# EAGLE design Yitran_IT900_Hutschiene_PIM7A_1_3 (EAGLE 6.4)
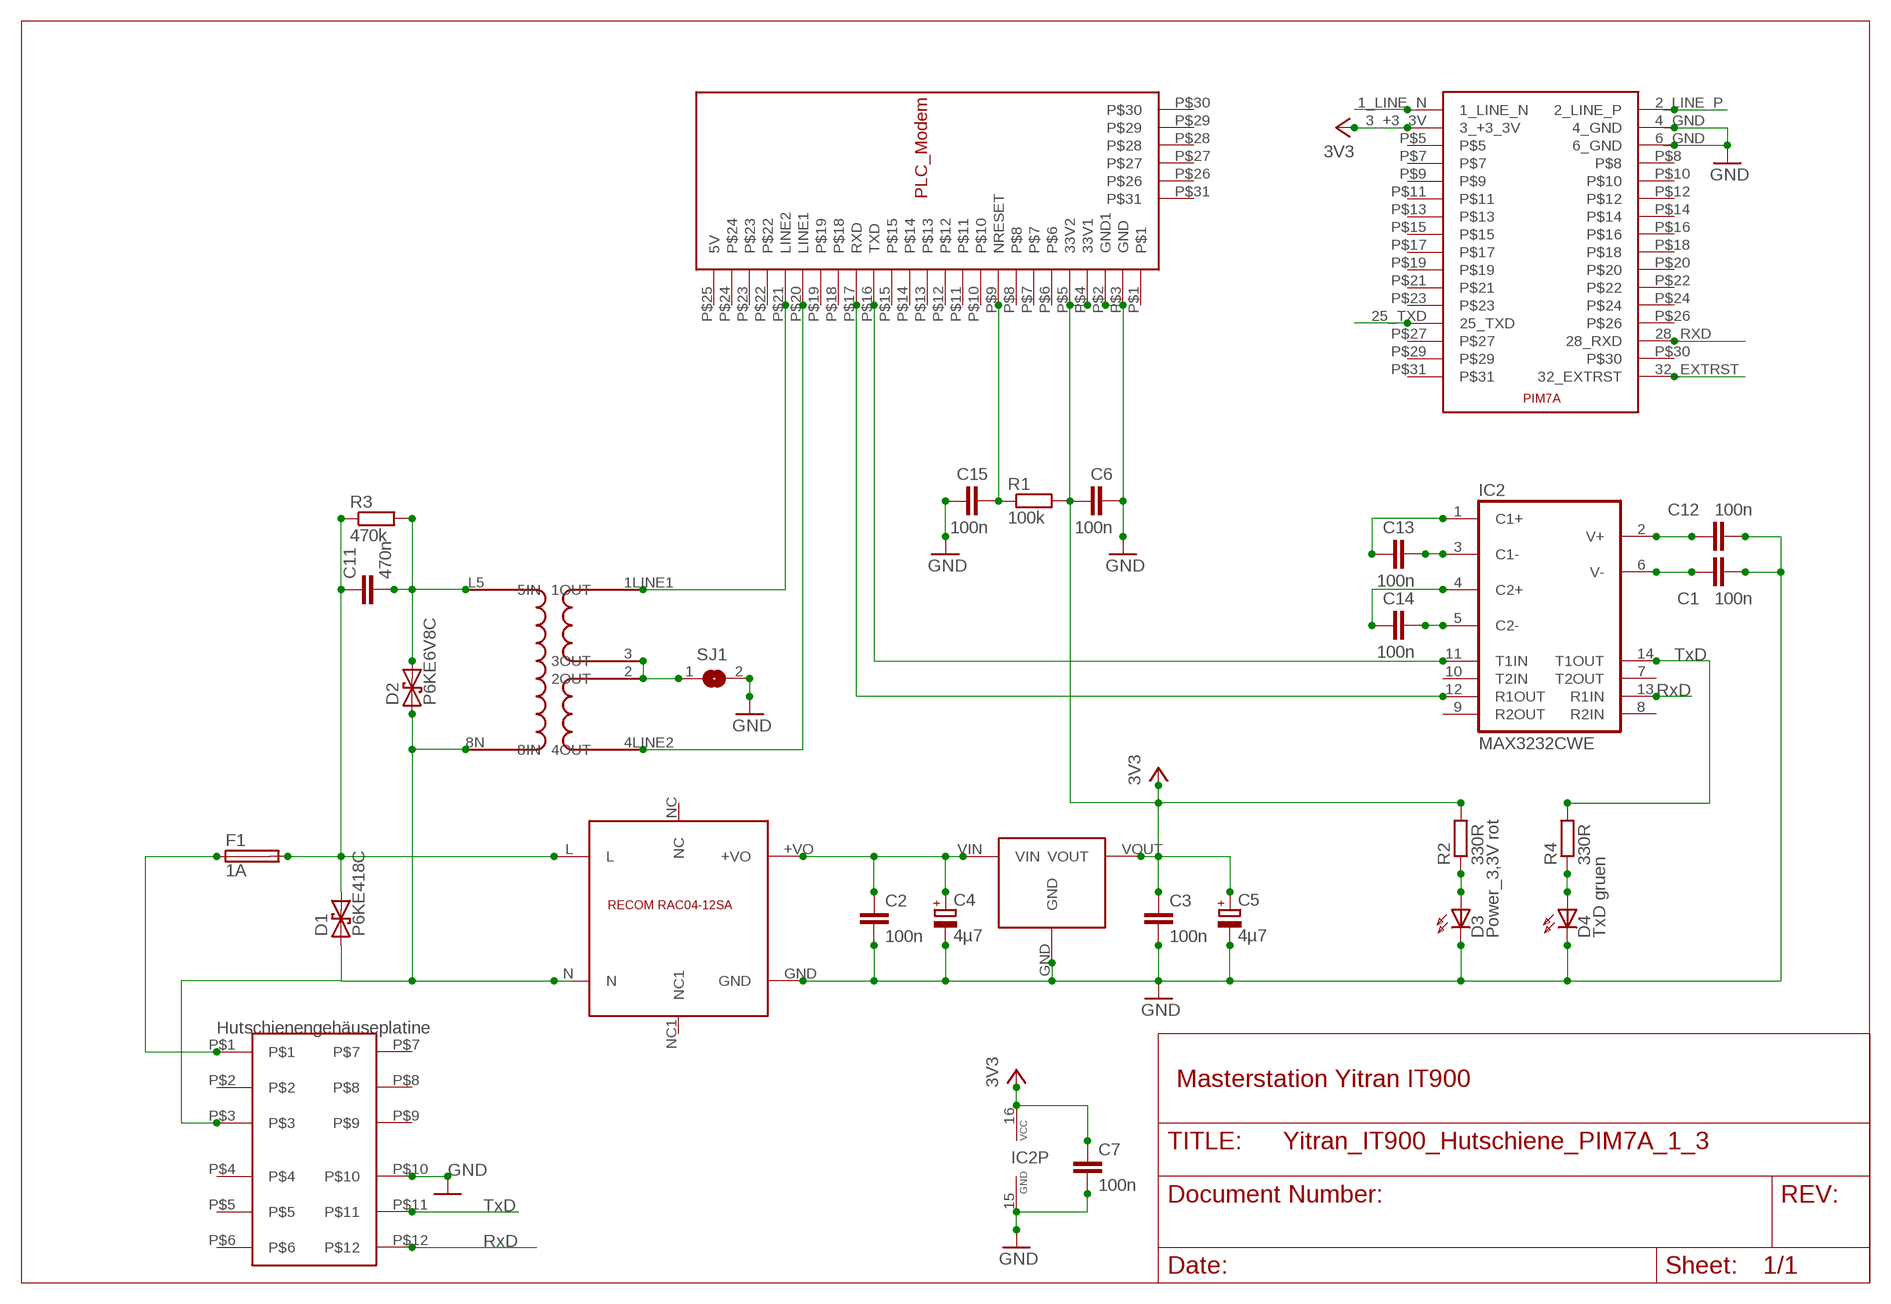
[diagram p0: schematic, sheet 1]

## Parts
C1  100n  C-EUC1206K  [C1206K]
C2  100n  C-EUC1206K  [C1206K]
C3  100n  C-EUC1206K  [C1206K]
C4  4µ7  CPOL-EUE2.5-5  [E2,5-5]
C5  4µ7  CPOL-EUE2.5-5  [E2,5-5]
C6  100n  C-EUC1206K  [C1206K]
C7  100n  C-EUC1206K  [C1206K]
C11  470n  C-EU150-091X182  [C150-091X182]
C12  100n  C-EUC1206K  [C1206K]
C13  100n  C-EUC1206K  [C1206K]
C14  100n  C-EUC1206K  [C1206K]
C15  100n  C-EUC1206K  [C1206K]
D1  P6KE418C  P6KEXXC  [CB417-15]
D2  P6KE6V8C  P6KEXXC  [CB417-15]
D3  Power_3,3V rot  HLMP6  [HLMP6]
D4  TxD gruen  HLMP6  [HLMP6]
F1  1A  TR5  [TR5]
IC2  MAX3232CWE  [SO16L]
R1  100k  R-EU_M1406  [M1406]
R2  330R  R-EU_R1206  [R1206]
R3  470k  R-EU_0309/10  [0309/10]
R4  330R  R-EU_R1206  [R1206]
SJ1  SJW  [SJW]
U$1  RECOM_783_3  RECOM_785_05  [RECOM785X]
U$2  LDG-A-12  [LDG-A-12]
U$3  MODEMSTECKER  [MODEM_FUSS]
U$4  IT900PIM7A  [IT900PIM7A]
U$9  RECOM_RAC04_12SA  [RAC04_12SA]
U$10  PLC_UEBERTRAGER_V2  [PLC-UEBERTRAGER_V2]

## Nets
3V3: C3.1 C5.+ C6.1 C7.1 IC2.16(VCC) R1.2 R2.2 U$1.VOUT U$3.P$4(33V1) U$3.P$5(33V2) U$4.3_+3_3V
EXTRST: C15.2 R1.1 U$3.P$9(NRESET) U$4.32_EXTRST
GND: C1.2 C2.2 C3.2 C4.- C5.- C6.2 C7.2 C12.2 C15.1 D3.K D4.K IC2.15(GND) SJ1.2 U$1.GND U$2.P$10 U$3.P$2(GND1) U$3.P$3(GND) U$4.4_GND U$4.6_GND U$9.GND
L: C11.1 D1.C F1.2 R3.1 U$9.L
LINE1: U$3.P$20(LINE1) U$4.1_LINE_N U$10.4LINE2(4OUT)
LINE2: U$3.P$21(LINE2) U$4.2_LINE_P U$10.1LINE1(1OUT)
N: D1.A D2.A U$2.P$3 U$9.N U$10.8N(8IN)
N$1: F1.1 U$2.P$1
N$2: C11.2 D2.C R3.2 U$10.L5(5IN)
N$3: C2.1 C4.+ U$1.VIN U$9.+VO
N$4: D3.A R2.1
N$5: C12.1 IC2.2(V+)
N$7: C13.1 IC2.1(C1+)
N$8: C13.2 IC2.3(C1-)
N$9: C14.1 IC2.4(C2+)
N$10: C14.2 IC2.5(C2-)
N$12: C1.1 IC2.6(V-)
N$13: D4.A R4.1
N$14: SJ1.1 U$10.2(2OUT) U$10.3(3OUT)
RX: IC2.12(R1OUT) U$3.P$17(RXD) U$4.28_RXD
RXD: IC2.13(R1IN) U$2.P$12
TX: IC2.11(T1IN) U$3.P$16(TXD) U$4.25_TXD
TXD: IC2.14(T1OUT) R4.2 U$2.P$11
Unconnected: IC2.7(T2OUT) IC2.8(R2IN) IC2.9(R2OUT) IC2.10(T2IN) U$2.P$2 U$2.P$4 U$2.P$5 U$2.P$6 U$2.P$7 U$2.P$8 U$2.P$9 U$3.P$1 U$3.P$6 U$3.P$7 U$3.P$8 U$3.P$10 U$3.P$11 U$3.P$12 U$3.P$13 U$3.P$14 U$3.P$15 U$3.P$18 U$3.P$19 U$3.P$22 U$3.P$23 U$3.P$24 U$3.P$25(5V) U$3.P$26 U$3.P$27 U$3.P$28 U$3.P$29 U$3.P$30 U$3.P$31 U$4.P$5 U$4.P$7 U$4.P$8 U$4.P$9 U$4.P$10 U$4.P$11 U$4.P$12 U$4.P$13 U$4.P$14 U$4.P$15 U$4.P$16 U$4.P$17 U$4.P$18 U$4.P$19 U$4.P$20 U$4.P$21 U$4.P$22 U$4.P$23 U$4.P$24 U$4.P$26 U$4.P$27 U$4.P$29 U$4.P$30 U$4.P$31 U$9.NC U$9.NC1

## Notes on the sheet
- TxD
- RxD
- Hutschienengehäuseplatine
- Masterstation Yitran IT900
- TxD
- RxD

## Library data of the parts
C1-C3 C6 C7 C11-C15 = resistor:C-EU: CAPACITOR, European symbol
C4 C5 = resistor:CPOL-EU: POLARIZED CAPACITOR, European symbol
D1 D2 = diode:P6KEXXC: DIODE transient-voltage suppressor
D3 D4 = display-hp:HLMP6: LED 2mm horizontal; MF: AGILENT TECHNOLOGIES; MPN: HLMP-6500; OC_FARNELL: 1652490; OC_NEWARK: 40K0088
F1 = fuse:TR5: FUSE Wickmann; OC_FARNELL: unknown; OC_NEWARK: unknown
IC2 = maxim:MAX3232*: True RS-232 Transceivers 3.0V to 5.5V, Low-Power up to 1Mbps, Using Four 0.1µF External Capacitors Source: http://pdfserv.maxim-ic.com/en/ds/MAX3222-MAX3241.pdf; MF: MAXIM; MPN: MAX3232CWE+; OC_FARNELL: 9725504; OC_NEWARK: 68K4630
R1-R4 = resistor:R-EU_: RESISTOR, European symbol
SJ1 = jumper:SJ: SMD solder JUMPER
U$1 = ADS:RECOM_785_05
U$2 = Erni_LDG_A_12_Leiterplatte:LDG-A-12
U$3 = ADS:MODEMSTECKER
U$4 = ADS1:IT900PIM7A
U$9 = ADS:RECOM_RAC04_12SA
U$10 = ADS:PLC_UEBERTRAGER_V2

## Board
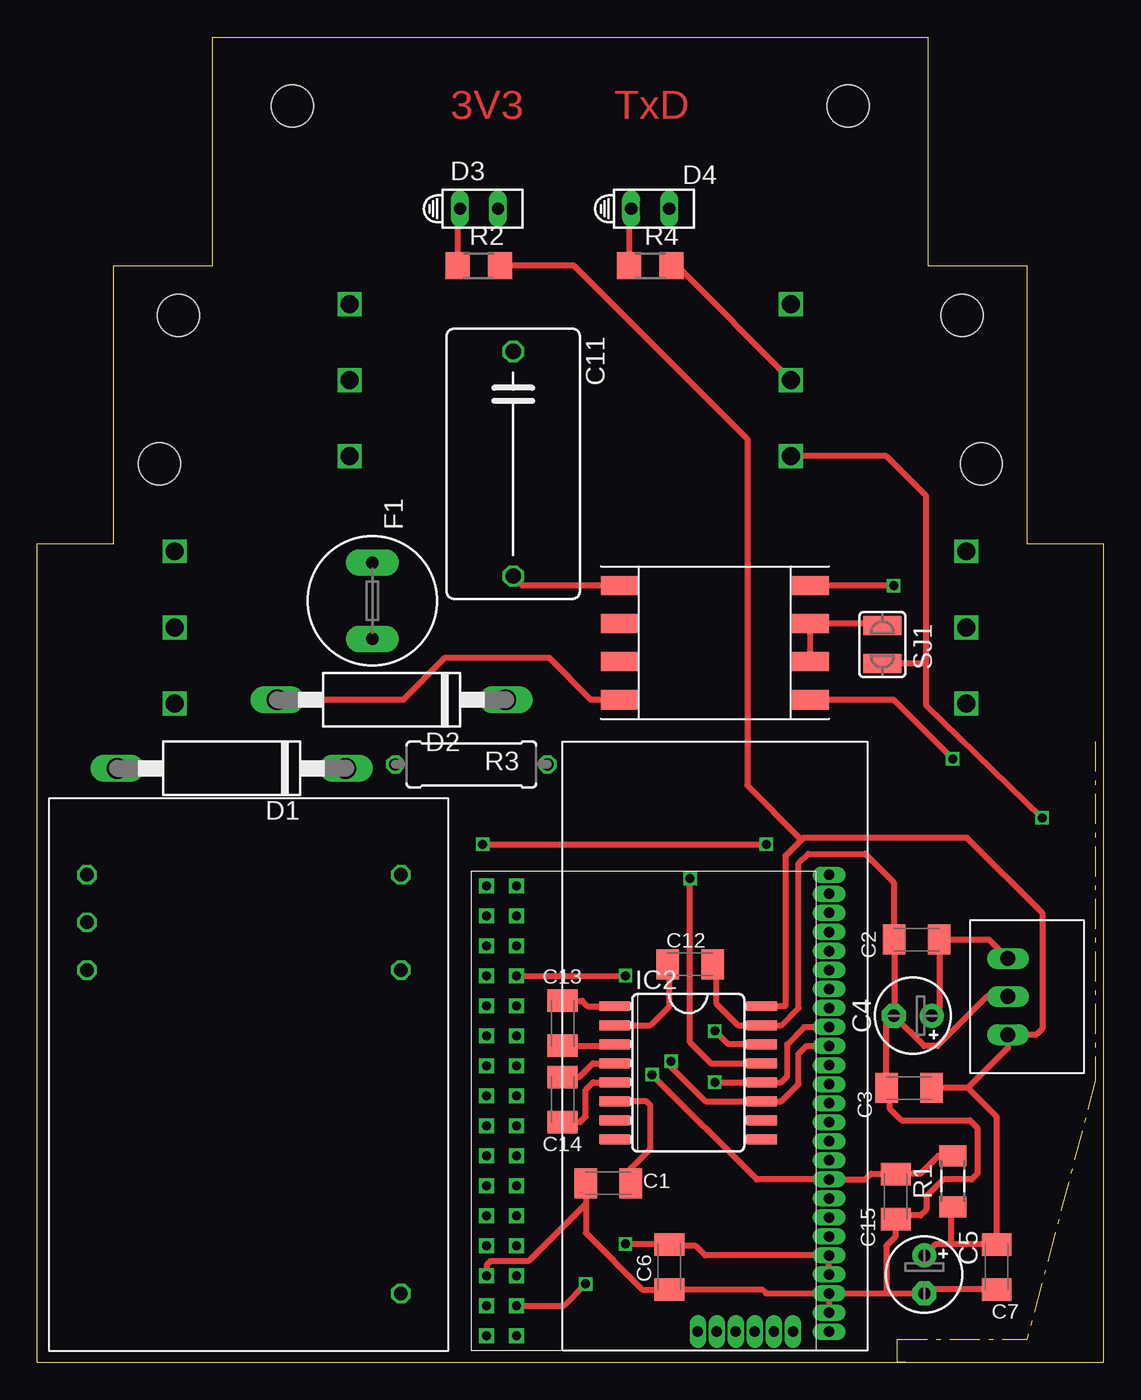
[diagram p1: board, top side]
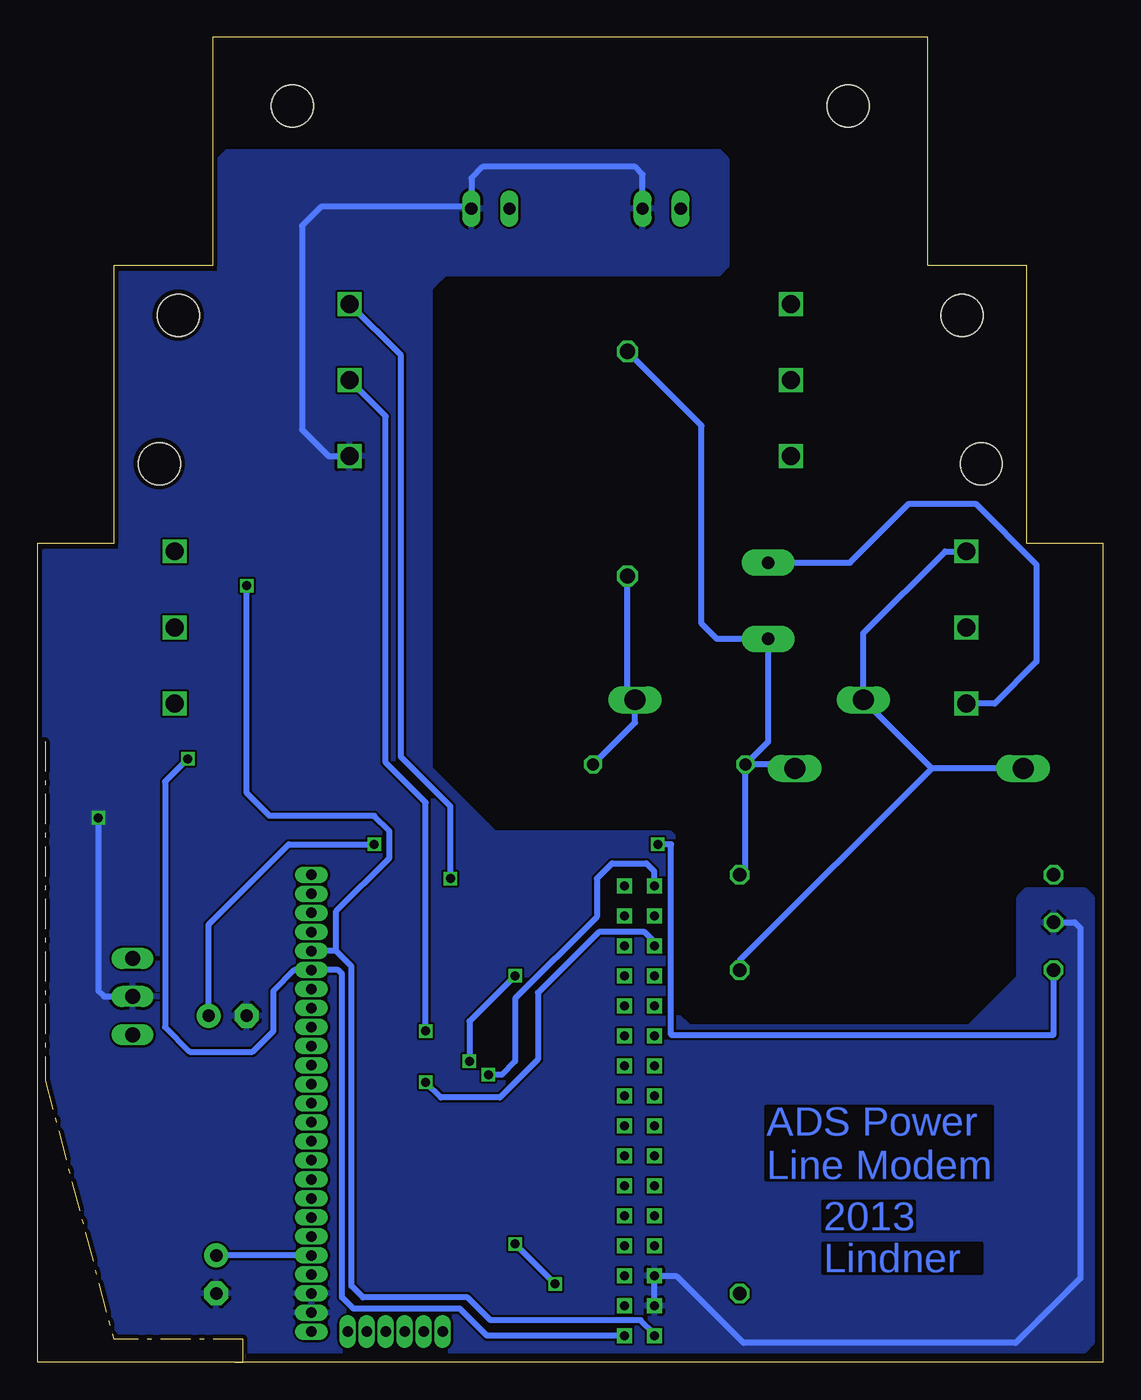
[diagram p2: board, bottom side, seen from below]

Size 71.12 x 88.39 mm. Coordinates in mm from the lower left corner, seen from the top.
Copper layers (1*16): Top 0.035mm / dielectric 1.5mm / Bottom 0.035mm
Design rules "PCB-POOL Standard": minimum track width 0.15mm, minimum drill 0.3mm, track to track 0.15mm, track to pad 0.15mm, pad to pad 0.15mm, via to via 0.15mm, smd to smd 0.15mm, copper to edge 0.3mm, drill to drill 0.2mm, minimum pad ring 0.2mm, minimum via ring 0.15mm, stop-mask expansion 0.075mm, vias tented up to drill 0mil, thermal gap 0.2mm

### Footprints (pad centres in the part's own frame; a part is rotated, then mirrored left to right if it is on the bottom)
C1206K = smd 1.5 x 2: 1 -1.5,0; 2 1.5,0
E2,5-5 = drill 0.813 pad 1.6: + -1.27,0 | drill 0.813 pad 1.6 octagon: - 1.27,0
C150-091X182 = drill 1.016 octagon: 1 -7.493,0; 2 7.493,0
CB417-15 = drill 1.397 long: A 7.62,0; C -7.62,0
HLMP6 = drill 0.813 long: A -1.27,0; K 1.27,0
TR5 = drill 0.813 pad 1.778 long: 1 -2.54,0; 2 2.54,0
SO16L = smd 0.66 x 2.032: 1 -4.445,-4.902; 2 -3.175,-4.902; 3 -1.905,-4.902; 4 -0.635,-4.902; 5 0.635,-4.902; 6 1.905,-4.902; 7 3.175,-4.902; 8 4.445,-4.902; 9 4.445,4.902; 10 3.175,4.902; 11 1.905,4.902; 12 0.635,4.902; 13 -0.635,4.902; 14 -1.905,4.902; 15 -3.175,4.902; 16 -4.445,4.902
M1406 = smd 1.4 x 1.8: 1 -1.7,0; 2 1.7,0
R1206 = smd 1.6 x 1.803: 1 -1.422,0; 2 1.422,0
0309/10 = drill 0.813 octagon: 1 -5.08,0; 2 5.08,0
SJW = smd 1.27 x 2.54: 1 -1.27,0; 2 1.27,0
RECOM785X = drill 1 long: GND 0,2.54; VIN -2.54,2.54; VOUT 2.54,2.54
LDG-A-12 = drill 1.2 square: P$1 -26.416,-44.45; P$2 -26.416,-39.37; P$3 -26.416,-34.29; P$4 -14.732,-27.94; P$5 -14.732,-22.86; P$6 -14.732,-17.78; P$7 26.416,-44.45; P$8 26.416,-39.37; P$9 26.416,-34.29; P$10 14.732,-27.94; P$11 14.732,-22.86; P$12 14.732,-17.78 | hole 2.8: -18.542,-4.572; 18.542,-4.572; 26.162,-18.542; -26.162,-18.542; -27.432,-28.448; 27.432,-28.448
MODEM_FUSS = drill 0.7 pad 0.813 long: P$1 -20.32,-8.89; P$2 -19.05,-8.89; P$3 -17.78,-8.89; P$4 -16.51,-8.89; P$5 -15.24,-8.89; P$6 -13.97,-8.89; P$7 -12.7,-8.89; P$8 -11.43,-8.89; P$9 -10.16,-8.89; P$10 -8.89,-8.89; P$11 -7.62,-8.89; P$12 -6.35,-8.89; P$13 -5.08,-8.89; P$14 -3.81,-8.89; P$15 -2.54,-8.89; P$16 -1.27,-8.89; P$17 0,-8.89; P$18 1.27,-8.89; P$19 2.54,-8.89; P$20 3.81,-8.89; P$21 5.08,-8.89; P$22 6.35,-8.89; P$23 7.62,-8.89; P$24 8.89,-8.89; P$25 10.16,-8.89; P$29 -20.32,-3.937; P$30 -20.32,-5.207; P$31 -20.32,-6.477 | drill 0.7 pad 0.61 long: P$26 -20.32,-0.127; P$27 -20.32,-1.397; P$28 -20.32,-2.667
IT900PIM7A = drill 0.6 square: 1_LINE_N 1,-3; 2_LINE_P 1,-1; 3_+3_3V 3,-3; 4_GND 3,-1; 6_GND 5,-1; 25_TXD 25,-3; 28_RXD 27,-1; 32_EXTRST 31,-1; P$5 5,-3; P$7 7,-3; P$8 7,-1; P$9 9,-3; P$10 9,-1; P$11 11,-3; P$12 11,-1; P$13 13,-3; P$14 13,-1; P$15 15,-3; P$16 15,-1; P$17 17,-3; P$18 17,-1; P$19 19,-3; P$20 19,-1; P$21 21,-3; P$22 21,-1; P$23 23,-3; P$24 23,-1; P$26 25,-1; P$27 27,-3; P$29 29,-3; P$30 29,-1; P$31 31,-3
RAC04_12SA = drill 0.9 octagon: +VO 25.4,24.13; GND 28.575,24.13; L 31.75,3.175; N 25.4,3.175; NC 3.81,3.175; NC1 31.75,24.13
PLC-UEBERTRAGER_V2 = smd 2.54 x 1.27: 1LINE1 6.35,3.81; 2 6.35,1.27; 3 6.35,-1.27; 4LINE2 6.35,-3.81; 6NC -6.35,1.27; 7NC -6.35,-1.27; 8N -6.35,-3.81; L5 -6.35,3.81

### Placement (x,y rotation side)
C1  38.1,11.94 180 top
C2  58.67,28.19 180 top
C3  58.17,18.29 180 top
C4  58.42,23.11 180 top
C5  59.18,5.84 270 top
C6  42.16,6.35 270 top
C7  64.01,6.35 270 top
C11  31.75,59.94 270 top
C12  43.56,26.54 0 top
C13  35.05,22.61 270 top
C14  35.05,17.53 270 top
C15  57.28,11.05 90 top
D1  12.95,39.62 180 top
D2  23.62,44.2 180 top
D3  29.46,76.96 0 top
D4  40.89,76.96 0 top
F1  22.35,50.8 270 top
IC2  43.43,19.3 270 top
R1  61.09,12.06 270 top
R2  29.46,73.15 0 top
R3  28.96,39.88 0 top
R4  40.89,73.15 0 top
SJ1  56.39,47.88 270 top
U$1  62.23,24.38 270 top
U$2  35.56,88.39 0 top
U$3  43.94,22.35 90 top
U$4  28.96,0.76 90 top
U$9  27.43,0.76 90 top
U$10  45.21,48.01 0 top

### Tracks (layer width: path | path; a pad name or v marks a point on that pad's centre or on a via)
3V3  (via drill 0.6)
  Top 0.406: U$3.P$4 U$3.P$5 44.58,7.11 43.94,7.75 42.27,7.75 C6.1 42.14,7.87 v39.24,7.87 | 60.96,7.85 C7.1 64.01,16.38 62.1,18.29 | 60.96,7.85 59.92,7.85 C5.+ | 59.36,17.98 C3.1 62.1,18.29 | 62.1,18.29 64.77,20.95 U$1.VOUT 66.68,21.84 67.06,22.22 67.06,29.97 62.04,34.99 51.12,34.99 | U$4.3_+3_3V 35.13,3.76 v36.58,5.21 | IC2.16 49.91,23.75 49.91,33.78 51.12,34.99 | R2.2 35.81,73.15 47.37,61.59 47.37,38.48 50.86,34.99 51.12,34.99 | R1.2 60.96,10.36 60.96,7.85
  Bottom 0.406: U$3.P$5 C5.+ | v36.58,5.21 v39.24,7.87
EXTRST  (via drill 0.6)
  Top 0.406: v41.02,19.18 48.01,12.19 U$3.P$9 55.25,12.19 55.63,12.57 57.25,12.57 C15.2 57.3,12.57 58.93,12.57 60.12,13.76 R1.1
  Bottom 0.406: U$4.32_EXTRST 29.97,31.78 29.97,32.77 30.48,33.27 32.77,33.27 33.78,32.26 33.78,29.72 39.24,24.26 39.24,20.07 40.13,19.18 v41.02,19.18
GND  (via drill 0.6)
  Top 0.406: U$4.6_GND 29.97,5.78 29.97,6.48 30.23,6.73 32.77,6.73 36.6,10.56 C1.2 36.6,8.61 40.39,4.83 42.14,4.83 C6.2 48.36,4.85 48.64,4.57 U$3.P$3 | U$3.P$3 U$3.P$2 | U$3.P$3 56.77,4.57 | 56.77,4.57 C5.- 59.46,4.85 C7.2 | 56.77,4.57 56.64,4.7 56.64,7.75 57.28,8.38 C15.1 57.51,9.78 58.93,9.78 59.31,10.16 59.31,11.05 60.45,12.19 62.36,12.19 62.74,12.57 62.74,15.62 62.23,16.13 57.66,16.13 56.9,16.89 56.9,18.06 C3.2 56.67,22.63 C4.- | U$1.GND 63.37,24.38 60.07,21.08 59.18,21.08 C4.- | C4.- 57.17,23.14 C2.2 57.15,28.22 57.15,32 55.25,33.91 51.44,33.91 50.8,33.27 50.8,23.62 49.66,22.48 IC2.15 46.74,22.48 45.32,23.9 45.32,26.29 C12.2 | 59.31,46.61 59.31,57.78 56.64,60.45 U$2.P$10 | 56.77,46.61 SJ1.2 59.31,46.61 | v67.06,36.32 59.31,43.81 59.31,46.61
  Bottom 0.406: D3.K 30.73,79.25 31.24,79.76 41.4,79.76 42.16,78.99 D4.K 42.29,77.09 52.2,77.09 53.47,75.82 53.47,62.23 51.69,60.45 U$2.P$10 | U$9.GND 1.91,29.34 1.52,28.96 1.52,5.59 5.84,1.27 24,1.27 28.45,5.71 29.91,5.71 U$4.6_GND U$4.4_GND | v67.06,36.32 67.06,24.76 66.68,24.38 U$1.GND
  pour Bottom: 0.76,30.99 0.76,1.27 1.27,0.76 69.85,0.76 70.61,1.52 70.61,54.1 65.53,54.1 65.53,72.64 58.93,72.64 58.93,80.26 58.42,80.77 25.65,80.77 25.15,80.26 25.15,73.15 25.65,72.64 43.94,72.64 44.7,71.88 44.96,71.63 44.96,39.62 41.15,35.81 40.64,35.31 28.96,35.31 28.45,34.8 28.45,23.11 27.69,22.35 8.89,22.35 5.59,25.65 5.59,30.99 5.08,31.5 1.27,31.5
L
  Bottom 0.406: U$9.L 23.88,32.89 R3.1 | D1.C 20.83,39.88 R3.1 | R3.1 22.35,41.4 F1.2 25.78,48.26 26.8,49.28 26.8,62.48 C11.1
LINE1  (via drill 0.6)
  Top 0.406: v61.09,40.26 57.15,44.2 U$10.4LINE2
  Bottom 0.406: U$4.1_LINE_N 41.13,1.76 42.93,3.56 50.04,3.56 50.8,4.32 50.8,25.91 51.05,26.16 U$3.P$20 53.98,26.16 55.37,24.76 55.37,22.1 56.77,20.7 60.96,20.7 62.61,22.35 62.61,38.73 v61.09,40.26
LINE2  (via drill 0.6)
  Top 0.406: v57.15,51.82 U$10.1LINE1
  Bottom 0.406: U$4.2_LINE_P 29.96,1.89 30.86,2.79 40.89,2.79 42.42,4.32 49.4,4.32 50.17,5.08 50.17,26.42 51.18,27.43 | 51.18,27.43 U$3.P$21 | 51.18,27.43 51.18,30.1 47.63,33.65 47.63,35.43 48.64,36.45 55.63,36.45 57.15,37.97 v57.15,51.82
N
  Top 0.406: U$10.8N 36.96,44.2 34.16,46.99 27.18,46.99 24.38,44.2 D2.A
  Bottom 0.406: D1.A 11.43,39.62 | 11.43,39.62 D2.A 16,48.64 10.54,54.1 U$2.P$3 | 11.43,39.62 24.26,26.8 U$9.N
N$1
  Bottom 0.406: F1.1 16.89,53.34 12.95,57.28 8.51,57.28 4.45,53.21 4.45,46.74 7.24,43.94 U$2.P$1
N$2
  Top 0.406: U$10.L5 32.39,51.82 C11.2
  Bottom 0.406: R3.2 31.24,42.67 D2.C 31.75,44.7 C11.2
N$3  (via drill 0.6)
  Top 0.406: U$1.VIN 63.5,28.19 C2.1 60.17,23.6 C4.+ | v29.72,34.54 v48.64,34.54
  Bottom 0.406: C4.+ 59.69,29.21 54.36,34.54 v48.64,34.54 | U$9.+VO 3.3,21.84 28.83,21.84 28.83,34.54 v29.72,34.54
N$4
  Top 0.406: D3.A 28.04,76.81 R2.1
N$5
  Top 0.406: IC2.2 40.89,22.48 42.16,23.75 42.16,26.06 C12.1
N$7
  Top 0.406: C13.1 36.35,24.11 36.7,23.75 IC2.1
N$8
  Top 0.406: C13.2 38.43,21.11 IC2.3
N$9
  Top 0.406: C14.1 36.17,19.03 37.08,19.94 IC2.4
N$10
  Top 0.406: C14.2 36.22,16.03 36.58,16.38 36.58,18.16 37.08,18.67 IC2.5
N$12
  Top 0.406: C1.1 39.6,12.93 40.89,14.22 40.89,17.14 40.64,17.4 IC2.6
N$13
  Top 0.406: D4.A 39.47,76.81 R4.1
N$14
  Top 0.406: U$10.3 U$10.2 56.26,49.28 SJ1.1
RX  (via drill 0.6)
  Top 0.406: U$3.P$17 51.18,22.35 50.04,21.21 50.04,19.05 49.66,18.67 IC2.12 v45.21,18.67
  Bottom 0.406: U$4.28_RXD 29.96,28.05 30.61,28.7 33.66,28.7 37.72,24.64 37.72,20.19 40.26,17.65 44.2,17.65 v45.21,18.67
RXD  (via drill 0.6)
  Top 0.406: v43.56,32.26 43.56,21.34 44.96,19.94 IC2.13
  Bottom 0.406: v43.56,32.26 43.56,37.08 46.86,40.39 46.86,67.18 U$2.P$12
TX  (via drill 0.6)
  Top 0.406: U$3.P$16 51.31,21.08 50.8,20.57 50.8,18.54 49.66,17.4 IC2.11 44.58,17.4 42.29,19.68 v42.29,20.07 | U$4.25_TXD 39.22,25.76 v39.24,25.78
  Bottom 0.406: v39.24,25.78 42.29,22.73 v42.29,20.07
TXD  (via drill 0.6)
  Top 0.406: IC2.14 46.1,21.21 v45.21,22.1 | U$2.P$11 42.67,73.15 R4.2
  Bottom 0.406: v45.21,22.1 45.21,37.34 47.88,40 47.88,63.12 U$2.P$11

### Text on the board
Top: 3V3 | TxD
Bottom: ADS Power / Line Modem | 2013 | Lindner